# EasyEDA Pro project ProDoc_v03_RAM_ROM_4Plane_2026-05-26.epro

# Schematic v03_RAM_ROM_4Plane
Board Name: v03_RAM_ROM_4Plane; Create Date: 2024-08-22; Page Name: v03_RAM_ROM_4Plane; Project Name: The20c_v03; Schematic Name: v03_RAM_ROM_4Plane; Update Date: 2026-05-26; Company: OsoLabs.tech; Drawn: OsoLabs; Page Size: A4; Part Number: v03_RAM_ROM_4Plane; Reviewed: OsoLabs; Version: v03_00
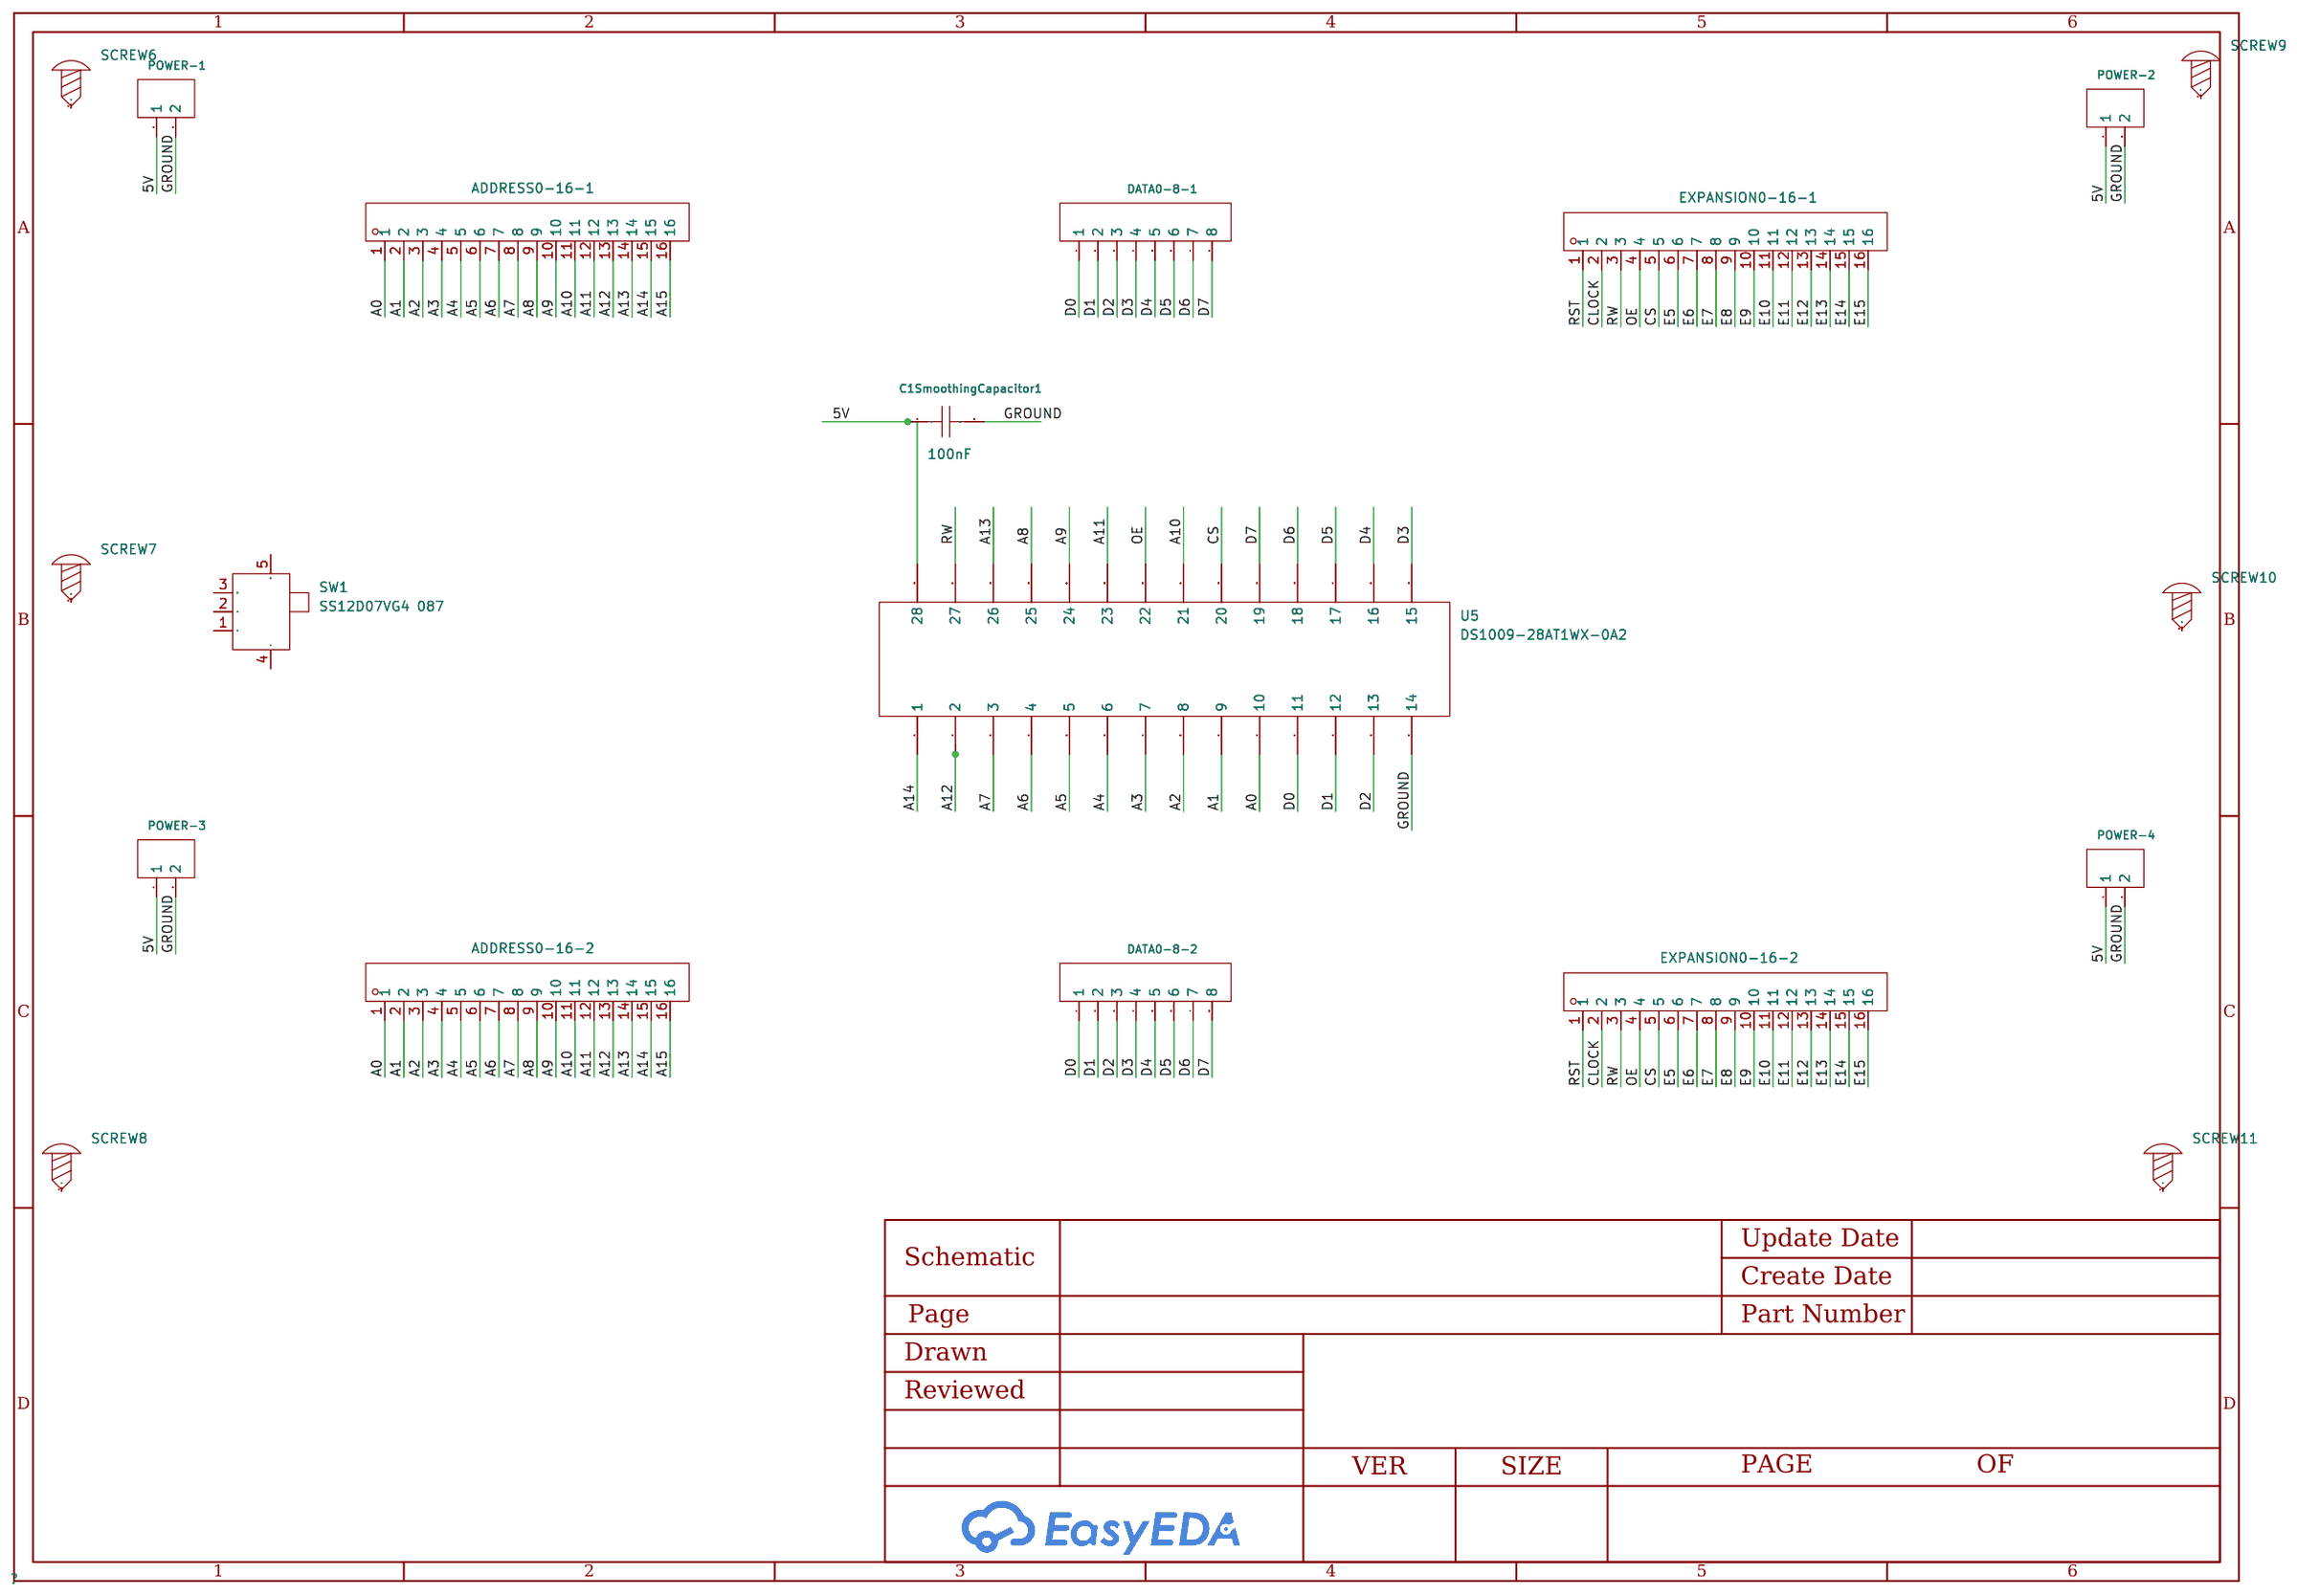
[diagram p0: schematic sheet]

## Parts
ADDRESS0-16-1  PM254-1-16-Z-8.5  [HDR-TH_16P-P2.54-V-F-A]
ADDRESS0-16-2  PM254-1-16-Z-8.5  [HDR-TH_16P-P2.54-V-F-A]
C1SmoothingCapacitor1  100nF  [CAP-TH_L5.8-W2.4-P2.54-D0.6]
DATA0-8-1  2.54-1*8P母环保  [HDR-TH_8P-P2.54-V-F-1]
DATA0-8-2  2.54-1*8P母环保  [HDR-TH_8P-P2.54-V-F-1]
EXPANSION0-16-1  PM254-1-16-Z-8.5  [HDR-TH_16P-P2.54-V-F-A]
EXPANSION0-16-2  PM254-1-16-Z-8.5  [HDR-TH_16P-P2.54-V-F-A]
POWER-1  2.54-1*2P母  [HDR-TH_2P-P2.54-V-F]
POWER-2  2.54-1*2P母  [HDR-TH_2P-P2.54-V-F]
POWER-3  2.54-1*2P母  [HDR-TH_2P-P2.54-V-F]
POWER-4  2.54-1*2P母  [HDR-TH_2P-P2.54-V-F]
SCREW6  -  [Screw-Hole-M3]
SCREW7  -  [Screw-Hole-M3]
SCREW8  -  [Screw-Hole-M3]
SCREW9  -  [Screw-Hole-M3]
SCREW10  -  [Screw-Hole-M3]
SCREW11  -  [Screw-Hole-M3]
SW1  SS12D07VG4 087  [SW-TH_SS12D07VG4]
U5  DS1009-28AT1WX-0A2  [DIP-28_L35.6-W17.8-P2.54-LS15.2-BL]

## Library data of the parts
ADDRESS0-16-1 ADDRESS0-16-2 EXPANSION0-16-1 EXPANSION0-16-2 = PM254-1-16-Z-8.5: Holes Structure:1x16P Pitch:2.54mm Row Spacing:- Circular Hole / Square Hole:Square Holes Mounting Type:Straight Number of Rows:Plugin Number of Holes:16P Current Rating (Max):3A Voltage Rating (Max):- Holes Direction:Top Insulation Height:8.5mm Contact M; LCSC Part Name: 1x16P 间距:2.54mm 直插; Supplier Part: C2897379; Manufacturer: HCTL(华灿天禄); Supplier Footprint: 插件,P=2.54mm; JLCPCB Part Class: Extended Part; Datasheet: https://atta.szlcsc.com/upload/public/pdf/source/20230609/534BE42964C679BDE98E061007C4ABD6.pdf; Supplier: LCSC; Holes Structure: 1x16P; Pitch: 2.54mm; Circular Hole / Square Hole: Square Holes; Mounting Type: Straight; Number of Rows: Plugin; Number of Holes: 16P; Current Rating (Max): 3A; Holes Direction: Top; Insulation Height: 8.5mm; Contact Material: Copper Alloy; Operating Temperature Range: -40℃~+105℃; Soldering Temperature(Max): 260℃@5S
C1SmoothingCapacitor1 = CC1H104ZA1ED3F5P1100: Capacitance:100nF Tolerance:-20%~+80% Tolerance:-20%~+80% Voltage Rated: Lead Spacing: Temperature Coefficient: φD: Body Thickness:2.4mm; LCSC Part Name: 100nF -20%~+80% 50V; Supplier Part: C2832506; Manufacturer: Dersonic(德尔创); Supplier Footprint: 插件,P=2.54mm; JLCPCB Part Class: Extended Part; Datasheet: https://atta.szlcsc.com/upload/public/pdf/source/20211027/619020FDD8EBC9BBFCA73A5584FA164D.pdf; Supplier: LCSC; Tolerance: -20%~+80%; Body Thickness: 2.4mm
DATA0-8-1 DATA0-8-2 = 2.54-1*8P母环保: Holes Structure:1x8P Pitch:2.54mm Row Spacing:- Mounting Type:Straight Number of Rows:Plugin Number of Holes:8P Insulation Height:- Contact Material:- Contact Plating:-; LCSC Part Name: 间距:2.54mm 1x8P 直插; Supplier Part: C27438; Manufacturer: BOOMELE(博穆精密); Supplier Footprint: 插件,P=2.54mm; JLCPCB Part Class: Extended Part; Datasheet: https://atta.szlcsc.com/upload/public/pdf/source/20231221/1CA800C6799ED97958773716FAA1BFFE.pdf; Supplier: LCSC; Holes Structure: 1x8P; Pitch: 2.54mm; Mounting Type: Straight; Number of Rows: Plugin; Number of Holes: 8P
POWER-1-POWER-4 = 2.54-1*2P母: Holes Structure:1x2P Pitch:2.54mm Row Spacing:- Mounting Type:Straight Number of Rows:Plugin Number of Holes:2P Insulation Height:- Contact Material:- Contact Plating:-; LCSC Part Name: 间距:2.54mm 1x2P 直插; Supplier Part: C49661; Manufacturer: BOOMELE(博穆精密); Supplier Footprint: 插件,P=2.54mm; JLCPCB Part Class: Extended Part; Datasheet: https://atta.szlcsc.com/upload/public/pdf/source/20210301/C2718488_F4427B881E42CAA8DDB0B1C12B3A522C.pdf; Supplier: LCSC; Holes Structure: 1x2P; Pitch: 2.54mm; Mounting Type: Straight; Number of Rows: Plugin; Number of Holes: 2P
SCREW6-SCREW11 = Screw-Hole-M3: Supplier Footprint: 插件
SW1 = SS12D07VG4 087: Circuit:SPDT Actuator Style:- Pin Style:PCPin Switch Length:8.7mm Switch Width:4.4mm Switch Height:4.7mm Mounting Style:Straight Actuator Color:- Current Rating (DC):500mA Voltage Rating (DC):50V Current Rating (AC):- Voltage Rating (AC):- Mechanical Life; Supplier Part: C2939726; Manufacturer: SHOU HAN(首韩); Supplier Footprint: 插件; JLCPCB Part Class: Extended Part; Datasheet: https://atta.szlcsc.com/upload/public/pdf/source/20220106/E715996F66241B9FD900079FF66489BE.pdf; Supplier: LCSC; Circuit: SPDT; Pin Style: PCPin; Switch Length: 8.7mm; Switch Width: 4.4mm; Switch Height: 4.7mm; Mounting Style: Straight; Current Rating (DC): 500mA; Voltage Rating (DC): 50V; Mechanical Life: 5千次; Operating Temperature: -10℃~+50℃
U5 = DS1009-28AT1WX-0A2: Adaptation Package Type:DIP Pitch:2.54mm Row Spacing:15.24mm Number of Positions:28P Contact Plating:Tin; LCSC Part Name: 间距2.54mm P数:28P; Supplier Part: C72121; Manufacturer: CONNFLY; Supplier Footprint: DIP-28; JLCPCB Part Class: Extended Part; Datasheet: https://atta.szlcsc.com/upload/public/pdf/source/20160429/1461922462758.pdf; Supplier: LCSC; Adaptation Package Type: DIP; Pitch: 2.54mm; Row Spacing: 15.24mm; Number of Positions: 28P; Contact Plating: Tin

## Nets
5V: C1SmoothingCapacitor1.1 POWER-1.1 POWER-2.1 POWER-3.1 POWER-4.1 U5.28
A0: ADDRESS0-16-1.1 ADDRESS0-16-2.1 U5.10
A1: ADDRESS0-16-1.2 ADDRESS0-16-2.2 U5.9
A2: ADDRESS0-16-1.3 ADDRESS0-16-2.3 U5.8
A3: ADDRESS0-16-1.4 ADDRESS0-16-2.4 U5.7
A4: ADDRESS0-16-1.5 ADDRESS0-16-2.5 U5.6
A5: ADDRESS0-16-1.6 ADDRESS0-16-2.6 U5.5
A6: ADDRESS0-16-1.7 ADDRESS0-16-2.7 U5.4
A7: ADDRESS0-16-1.8 ADDRESS0-16-2.8 U5.3
A8: ADDRESS0-16-1.9 ADDRESS0-16-2.9 U5.25
A9: ADDRESS0-16-1.10 ADDRESS0-16-2.10 U5.24
A10: ADDRESS0-16-1.11 ADDRESS0-16-2.11 U5.21
A11: ADDRESS0-16-1.12 ADDRESS0-16-2.12 U5.23
A12: ADDRESS0-16-1.13 ADDRESS0-16-2.13 U5.2
A13: ADDRESS0-16-1.14 ADDRESS0-16-2.14 U5.26
A14: ADDRESS0-16-1.15 ADDRESS0-16-2.15 U5.1
A15: ADDRESS0-16-1.16 ADDRESS0-16-2.16
CLOCK: EXPANSION0-16-1.2 EXPANSION0-16-2.2
CS: EXPANSION0-16-1.5 EXPANSION0-16-2.5 U5.20
D0: DATA0-8-1.1 DATA0-8-2.1 U5.11
D1: DATA0-8-1.2 DATA0-8-2.2 U5.12
D2: DATA0-8-1.3 DATA0-8-2.3 U5.13
D3: DATA0-8-1.4 DATA0-8-2.4 U5.15
D4: DATA0-8-1.5 DATA0-8-2.5 U5.16
D5: DATA0-8-1.6 DATA0-8-2.6 U5.17
D6: DATA0-8-1.7 DATA0-8-2.7 U5.18
D7: DATA0-8-1.8 DATA0-8-2.8 U5.19
E5: EXPANSION0-16-1.6 EXPANSION0-16-2.6
E6: EXPANSION0-16-1.7 EXPANSION0-16-2.7
E7: EXPANSION0-16-1.8 EXPANSION0-16-2.8
E8: EXPANSION0-16-1.9 EXPANSION0-16-2.9
E9: EXPANSION0-16-1.10 EXPANSION0-16-2.10
E10: EXPANSION0-16-1.11 EXPANSION0-16-2.11
E11: EXPANSION0-16-1.12 EXPANSION0-16-2.12
E12: EXPANSION0-16-1.13 EXPANSION0-16-2.13
E13: EXPANSION0-16-1.14 EXPANSION0-16-2.14
E14: EXPANSION0-16-1.15 EXPANSION0-16-2.15
E15: EXPANSION0-16-1.16 EXPANSION0-16-2.16
GROUND: C1SmoothingCapacitor1.2 POWER-1.2 POWER-2.2 POWER-3.2 POWER-4.2 U5.14
OE: EXPANSION0-16-1.4 EXPANSION0-16-2.4 U5.22
RST: EXPANSION0-16-1.1 EXPANSION0-16-2.1
RW: EXPANSION0-16-1.3 EXPANSION0-16-2.3 U5.27

Not connected (* = marked no-connect by the designer): SCREW6 1; SCREW7 1; SCREW8 1; SCREW9 1; SCREW10 1; SCREW11 1; SW1 1 2 3 4 5
